# Altium schematic sheet B293A ADC.SchDoc: ADC
size A4; DocumentNumber: 293; Revision: A
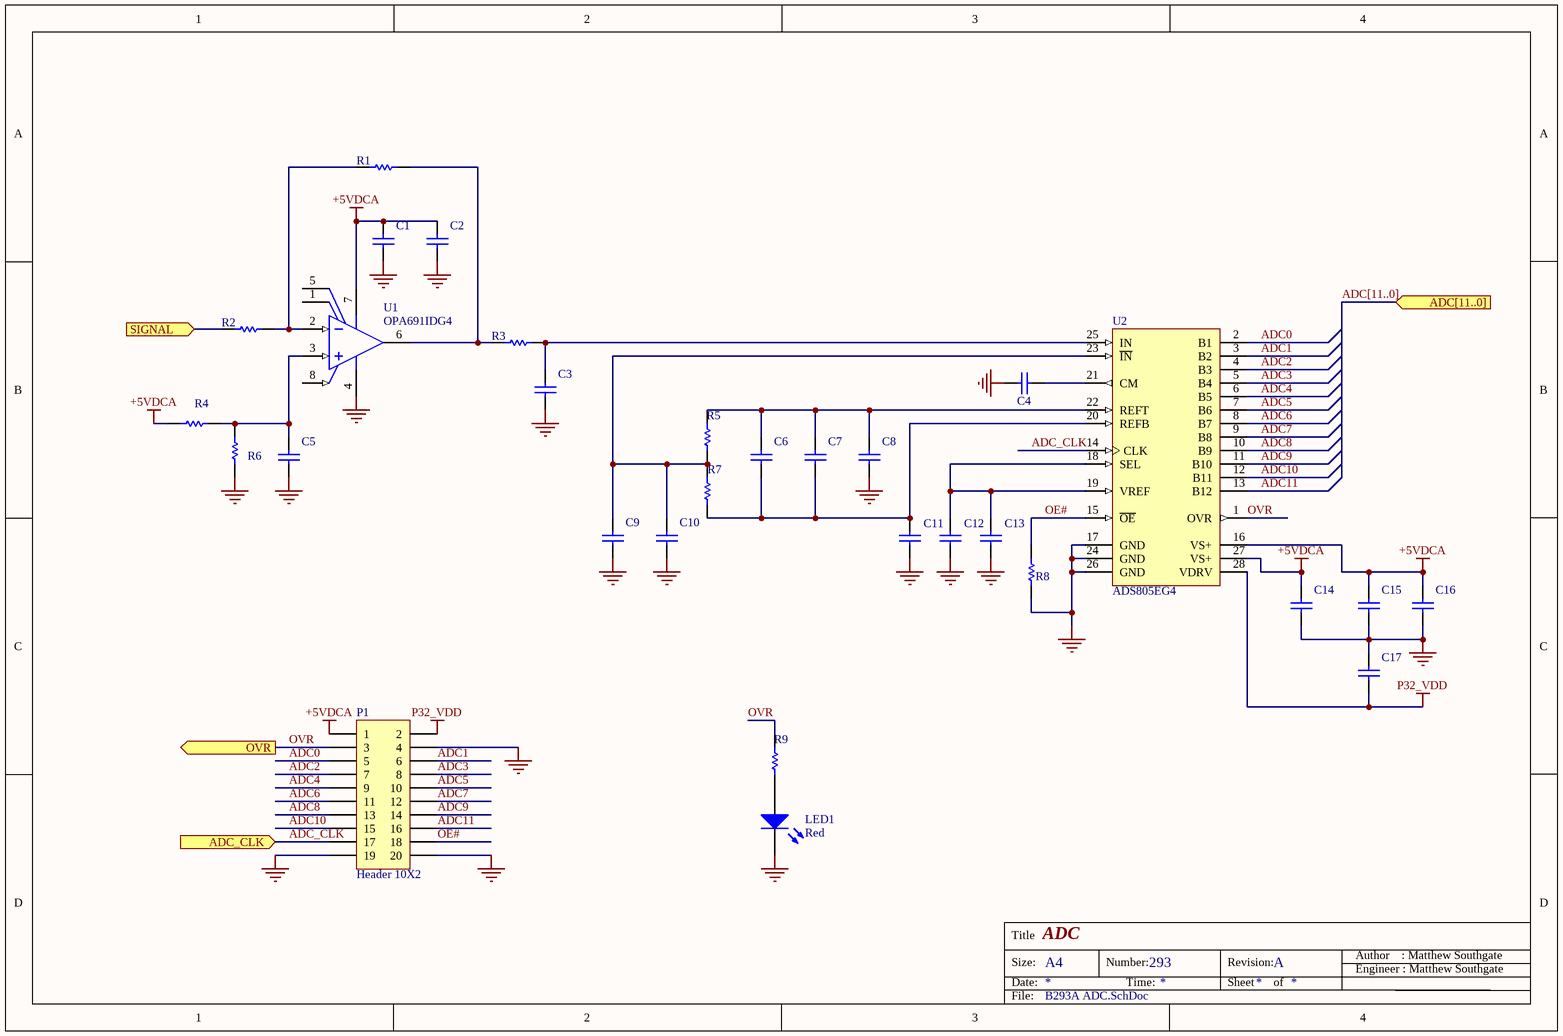
[diagram p0: B293A ADC.SchDoc]

## Parts
C1  CAP 100nF 50V 0805(2012)  [CAPC0805(2012)75_L]  (value not drawn)
C2  CAP 10uF 25V 0805(2012)  [CAPC0805(2012)145_N]  (value not drawn)
C3  CAP 1.5nF 50V 0805(2012)  [CAPC0805(2012)75_M]  (value not drawn)
C4  CAP 100nF 50V 0805(2012)  [CAPC0805(2012)75_L]  (value not drawn)
C5  CAP 100nF 50V 0805(2012)  [CAPC0805(2012)75_L]  (value not drawn)
C6  CAP 10uF 25V 0805(2012)  [CAPC0805(2012)145_N]  (value not drawn)
C7  CAP 100nF 50V 0805(2012)  [CAPC0805(2012)75_L]  (value not drawn)
C8  CAP 100nF 50V 0805(2012)  [CAPC0805(2012)75_L]  (value not drawn)
C9  CAP 10uF 25V 0805(2012)  [CAPC0805(2012)145_N]  (value not drawn)
C10  CAP 100nF 50V 0805(2012)  [CAPC0805(2012)75_L]  (value not drawn)
C11  CAP 100nF 50V 0805(2012)  [CAPC0805(2012)75_L]  (value not drawn)
C12  CAP 10uF 25V 0805(2012)  [CAPC0805(2012)145_N]  (value not drawn)
C13  CAP 100nF 50V 0805(2012)  [CAPC0805(2012)75_L]  (value not drawn)
C14  CAP 100nF 50V 0805(2012)  [CAPC0805(2012)75_L]  (value not drawn)
C15  CAP 100nF 50V 0805(2012)  [CAPC0805(2012)75_L]  (value not drawn)
C16  CAP 2.2uF 50V 0805(2012)  [CAPC0805(2012)145_M]  (value not drawn)
C17  CAP 100nF 50V 0805(2012)  [CAPC0805(2012)75_L]  (value not drawn)
LED1  Red  [1206 - LED]
P1  Header 10X2  [HDR2X10]
R1  1K8 5% 0805(2012)  [RESC0805(2012)_N]  (value not drawn)
R2  1K8 5% 0805(2012)  [RESC0805(2012)_N]  (value not drawn)
R3  47R 5% 0805(2012)  [RESC0805(2012)_M]  (value not drawn)
R4  1K8 5% 0805(2012)  [RESC0805(2012)_N]  (value not drawn)
R5  1K8 5% 0805(2012)  [RESC0805(2012)_N]  (value not drawn)
R6  680R 1% 0805(2012)  [RESC0805(2012)_L]  (value not drawn)
R7  1K8 5% 0805(2012)  [RESC0805(2012)_N]  (value not drawn)
R8  10K 1% 0805(2012)  [RESC0805(2012)_M]  (value not drawn)
R9  1K 5% 0805(2012)  [RESC0805(2012)_N]  (value not drawn)
U1  OPA691IDG4  [TI-D8_N]
U2  ADS805EG4  [TI-DB28_M]

## Ports
ADC[11..0] (in), ADC_CLK (in), OVR (out), SIGNAL (in)

## Nets
+5VDCA: C1.2 C2.2 C14.2 C15.2 C16.2 P1.1 R4.1 U1.7(VS+) U2.16(VS+) U2.27(VS+)
GND: C1.1 C2.1 C3.1 C4.1 C5.1 C8.1 C9.1 C10.1 C11.1 C12.1 C13.1 C14.1 C15.1 C16.1 C17.2 LED1.K P1.4 P1.19 P1.20 R6.2 R8.2 U1.4(VS-) U2.17(GND) U2.24(GND) U2.26(GND)
P32_VDD: C17.1 P1.2 U2.28(VDRV)
ADC0: P1.5 U2.2(B1)
ADC1: P1.6 U2.3(B2)
ADC2: P1.7 U2.4(B3)
ADC3: P1.8 U2.5(B4)
ADC4: P1.9 U2.6(B5)
ADC5: P1.10 U2.7(B6)
ADC6: P1.11 U2.8(B7)
ADC7: P1.12 U2.9(B8)
ADC8: P1.13 U2.10(B9)
ADC9: P1.14 U2.11(B10)
ADC10: P1.15 U2.12(B11)
ADC11: P1.16 U2.13(B12)
ADC_CLK: P1.17 U2.14(CLK) ; port ADC_CLK
OE#: P1.18 R8.1 U2.15(~{OE})
OVR: P1.3 R9.2 U2.1(OVR) ; port OVR
SIGNAL: R2.2 ; port SIGNAL
NetC3_2: C3.2 R3.1 U2.25(IN)
NetC4_2: C4.2 U2.21(CM)
NetC5_2: C5.2 R4.2 R6.1 U1.3(IN+)
NetC6_1: C6.1 C7.1 C11.2 R7.1 U2.20(REFB)
NetC6_2: C6.2 C7.2 C8.2 R5.2 U2.22(REFT)
NetC9_2: C9.2 C10.2 R5.1 R7.2 U2.23(~{IN})
NetC12_2: C12.2 C13.2 U2.18(SEL) U2.19(VREF)
NetLED1_A: LED1.A R9.1
NetR1_1: R1.1 R3.2 U1.6(OUT)
NetR1_2: R1.2 R2.1 U1.2(IN-)

Not connected (* = marked no-connect by the designer): U1 1(NC) 5(NC) 8(~{DIS})

## Buses and harness runs
bus ADC[11..0] = port ADC[11..0]

## Notes on the sheet
- Title
- Size:
- Date:
- A4
- Number:
- Time:
- Revision:
- Sheet
- of
- Engineer : Matthew Southgate
- Author    : Matthew Southgate
- File:

## Library data of the parts
C1 C4 C5 C7 C8 C10 C11 C13-C15 C17 = CMP-1036-04421-1: CAP 100nF 50V ±20% 0805 (2012 Metric) Thickness 0.75mm SMD; Case-Metric: 2012; Case-EIA: 0805; Value: 100nF; Max Thickness: 0.75 mm; Rated Voltage: 50 V; Tolerance: ±20%; Technology: SMT
C2 C6 C9 C12 = CMP-1036-04933-1: CAP 10uF 25V ±20% 0805 (2012 Metric) Thickness 1.45mm SMD; Case-EIA: 0805; Case-Metric: 2012; Technology: SMT; Tolerance: ±20%; Max Thickness: 1.45 mm; Value: 10uF; Rated Voltage: 25 V
C3 = CMP-1036-03122-1: CAP 1.5nF 50V ±10% 0805 (2012 Metric) Thickness 0.75mm SMD; Case-Metric: 2012; Case-EIA: 0805; Rated Voltage: 50 V; Technology: SMT; Value: 1.5nF; Max Thickness: 0.75 mm; Tolerance: ±10%
C16 = CMP-1036-04844-1: CAP 2.2uF 50V ±10% 0805 (2012 Metric) Thickness 1.45mm SMD; Case-Metric: 2012; Case-EIA: 0805; Tolerance: ±10%; Technology: SMT; Value: 2.2uF; Rated Voltage: 50 V; Max Thickness: 1.45 mm
LED1 = LED 1206 RED: LED, ALINGAP, SMD, 1206, RED; Manufacturer Part Number: KPC-3216SURCK; Manufacturer: KINGBRIGHT; Order Code: 1318261; Supplier: Farnell; Supplier 1: Farnell; RoHS: YES; Stock 1: 179; Pricing 1: 10=0.117, 50=0.097, 100=0.083, 250=0.074, 500=0.067, 800=0.0603, 800=0.0543, 7000=0.0488 (GBP); ComponentLink1URL: http://www.us.kingbright.com/images/catalog/SPEC/APC3216SURCK.pdf; ComponentLink1Description: http://www.us.kingbright.com/images/catalog/SPEC/APC3216SURCK.pdf; Supplier Part Number 1: 1318261
P1 = Header 10X2: Header, 10-Pin, Dual row; Fitted: No; LatestRevisionDate: 17-Jul-2002; LatestRevisionNote: Re-released for DXP Platform.; Publisher: Altium Limited
R1 R2 R4 R5 R7 = CMP-1013-00080-1: 1K8 0.125W 5% 0805 (2012 Metric)  SMD; Case-Metric: 2012; Value: 1800.00 Ohm; Case-EIA: 0805; Tolerance: 5 %; Technology: SMT; Power: 0.125 W
R3 = CMP-1013-00042-1: 47R 0.125W 5% 0805 (2012 Metric)  SMD; Value: 47.00 Ohm; Case-Metric: 2012; Case-EIA: 0805; Technology: SMT; Tolerance: 5 %; Power: 0.125 W
R6 = CMP-1013-00491-1: 680R 0.125W 1% 0805 (2012 Metric)  SMD; Case-EIA: 0805; Value: 680.00 Ohm; Case-Metric: 2012; Technology: SMT; Tolerance: 1 %; Power: 0.125 W
R8 = CMP-1013-00623-1: 10K 0.125W 1% 0805 (2012 Metric)  SMD; Case-Metric: 2012; Value: 10000.00 Ohm; Case-EIA: 0805; Power: 0.125 W; Technology: SMT; Tolerance: 1 %
R9 = CMP-1013-00074-1: 1K 0.125W 5% 0805 (2012 Metric)  SMD; Case-Metric: 2012; Case-EIA: 0805; Value: 1000.00 Ohm; Tolerance: 5 %; Technology: SMT; Power: 0.125 W
U1 = CMP-0018-00355-1: Wideband Current Feedback Operational Amplifier with Disable, 5 to 12 V, -40 to 85 degC, 8-pin SOIC (D8), Green (RoHS & no Sb/Br); Manufacturer: Texas Instruments; ComponentLink3Description: Package Specification; PackageVersion: 4040047-3/M, 06/2011; ComponentLink2Description: Datasheet; PackageReference: D8; DatasheetVersion: SBOS226D; ComponentLink1Description: Manufacturer URL; ComponentLink2URL: http://www.ti.com/general/docs/lit/getliterature.tsp?genericPartNumber=OPA691&fileType=pdf; ComponentLink3URL: http://www.ti.com/litv/pdf/msoi002j; PackageDescription: 8-Pin Plastic Small Outline, Body 4.9 x 3.9 mm, Pitch 1.27 mm; Code_JEDEC: MS-012; ComponentLink1URL: http://www.ti.com/
U2 = CMP-0003-00136-1: 12-Bit, 20 MSPS ADC Internal / External Reference, Flexible Input between 2 and 5 Vpp, Out of Range Indicator, -40 to 85 degC, 28-pin SOP (DB28), Green (RoHS & no Sb/Br); Manufacturer: Texas Instruments; PackageVersion: 4040065/E, 12/2001; ComponentLink2URL: http://www.ti.com/general/docs/lit/getliterature.tsp?genericPartNumber=ADS805&fileType=pdf; ComponentLink1URL: http://www.ti.com/; Code_JEDEC: MO-150; DatasheetVersion: SBAS073B; ComponentLink3URL: http://www.ti.com/lit/ml/msso002e/msso002e.pdf; ComponentLink1Description: Manufacturer URL; ComponentLink2Description: Datasheet; PackageDescription: 28-Pin Plastic Small Outline, Body 10.2 X 5.3 mm, Pitch 0.65 mm; PackageReference: DB28; ComponentLink3Description: Package Specification